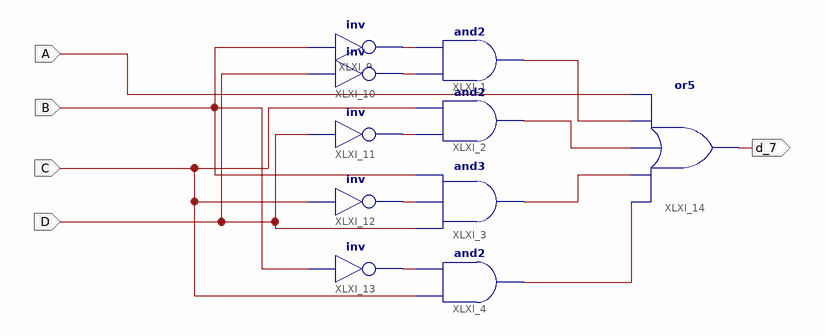
[diagram p0: schematic sheet 1]
// Xilinx ISE schematic d_7.sch (spartan6) as structural Verilog: 10 symbols, 5 ports
module d_7 (
  input  A,
  input  B,
  input  C,
  input  D,
  output d_7
);

  wire XLXN_7, XLXN_8, XLXN_9, XLXN_10, XLXN_11, XLXN_17, XLXN_18, XLXN_19, XLXN_20;

  and XLXI_1 (XLXN_17, XLXN_8, XLXN_7);
  and XLXI_2 (XLXN_18, XLXN_9, C);
  and XLXI_3 (XLXN_19, D, XLXN_10, B);
  and XLXI_4 (XLXN_20, C, XLXN_11);
  not XLXI_9 (XLXN_7, B);
  not XLXI_10 (XLXN_8, D);
  not XLXI_11 (XLXN_9, D);
  not XLXI_12 (XLXN_10, C);
  not XLXI_13 (XLXN_11, B);
  or XLXI_14 (d_7, XLXN_20, XLXN_19, XLXN_18, XLXN_17, A);
endmodule
